# Altium project ESP32_Projet.PrjPcb
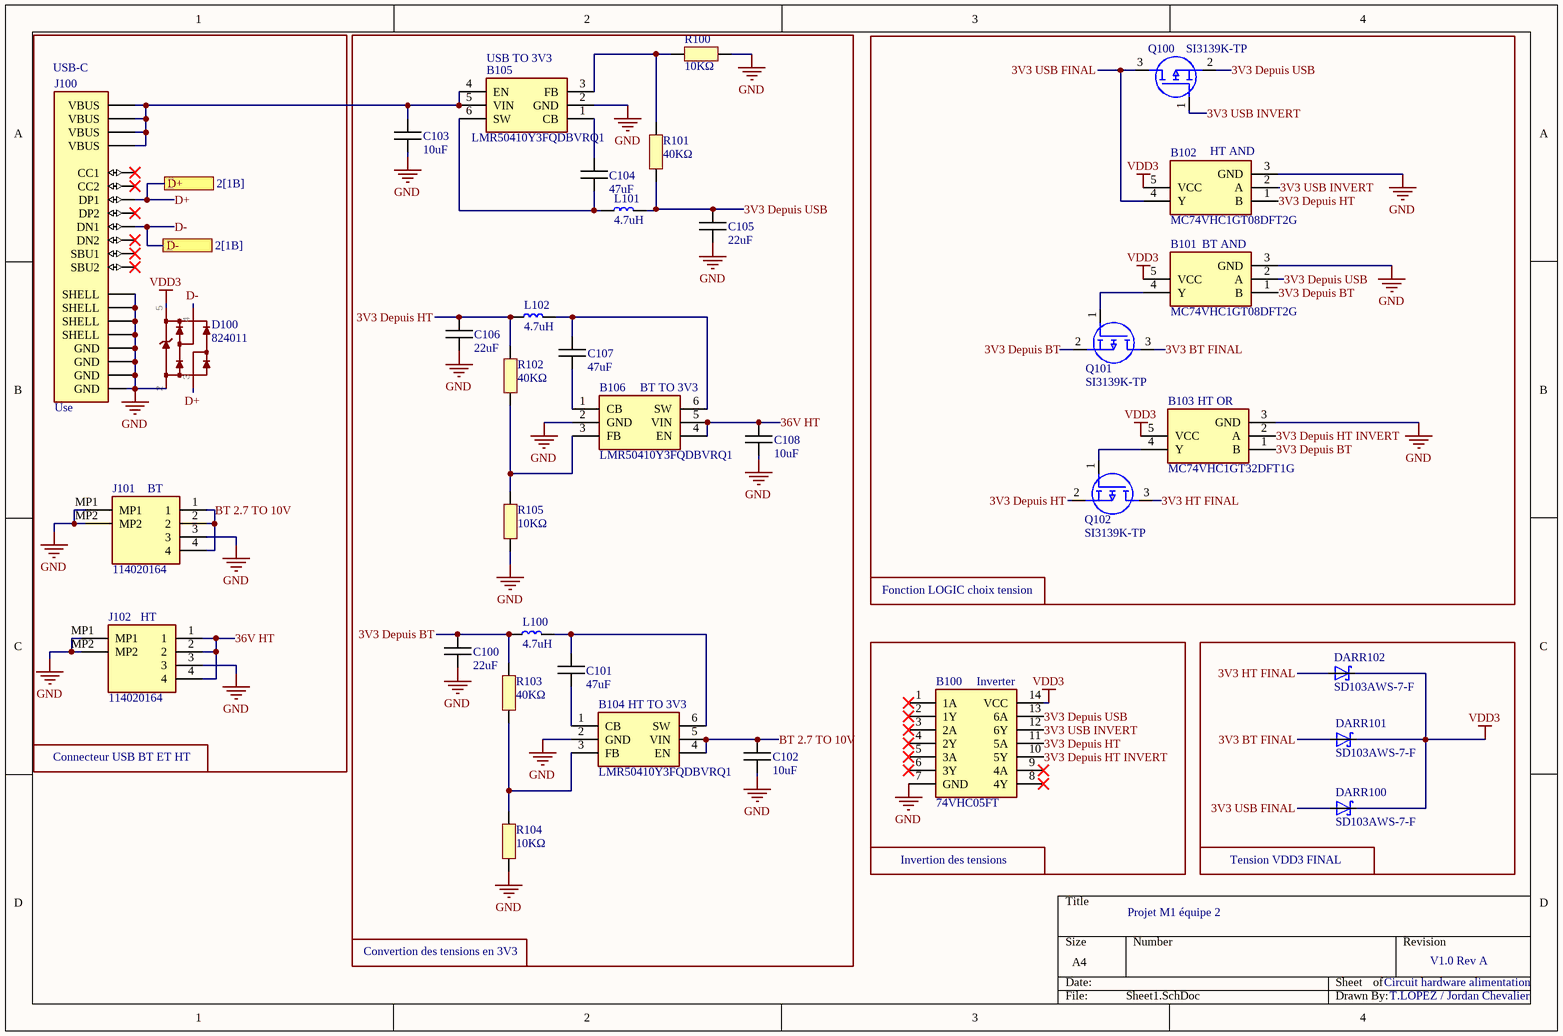
[diagram p0: Sheet1.SchDoc]
3 sheets, 76 parts. Net scope: flat (ports and power ports of the same name join across sheets).
Board file: PCB1.PcbDoc
Sheets:
  Sheet1.SchDoc
  Sheet2.SchDoc
  Sheet3.SchDoc

## Sheet Sheet1.SchDoc: Projet M1 équipe 2
size A4; Date: 18/11/2024; DrawnBy: T.LOPEZ / Jordan Chevalier; DocumentNumber: 1; Revision: V1.0 Rev A; SheetNumber: 1; SheetTotal: 3; Sheet Utility: Circuit hardware alimentation

### Parts
B100  74VHC05FT  [SOP65P640X120-14N]
B101  MC74VHC1GT08DFT2G  [SOT65P210X110-5N]
B102  MC74VHC1GT08DFT2G  [SOT65P210X110-5N]
B103  MC74VHC1GT32DFT1G  [SOT65P210X110-5N]
B104  LMR50410Y3FQDBVRQ1  [SOT95P280X145-6N]
B105  LMR50410Y3FQDBVRQ1  [SOT95P280X145-6N]
B106  LMR50410Y3FQDBVRQ1  [SOT95P280X145-6N]
C100  22uF  [CAPC1005X06N]
C101  47uF  [CAPC1005X06N]
C102  10uF  [CAPC1005X06N]
C103  10uF  [CAPC1005X06N]
C104  47uF  [CAPC1005X06N]
C105  22uF  [CAPC1005X06N]
C106  22uF  [CAPC1005X06N]
C107  47uF  [CAPC1005X06N]
C108  10uF  [CAPC1005X06N]
D100  824011  [824011]
DARR100  SD103AWS-7-F  [SD103AWS-7-F]
DARR101  SD103AWS-7-F  [SD103AWS-7-F]
DARR102  SD103AWS-7-F  [SD103AWS-7-F]
J100  Use  [USB4085-GF-A]
J101  114020164  [114020164]
J102  114020164  [114020164]
L100  4.7uH  [LQPC1005X06N]
L101  4.7uH  [LQPC1005X06N]
L102  4.7uH  [LQPC1005X06N]
Q100  SI3139K-TP  [SI3139K-TP]
Q101  SI3139K-TP  [SI3139K-TP]
Q102  SI3139K-TP  [SI3139K-TP]
R100  10KΩ  [RESC1005X06N]
R101  40KΩ  [RESC1005X06N]
R102  40KΩ  [RESC1005X06N]
R103  40KΩ  [RESC1005X06N]
R104  10KΩ  [RESC1005X06N]
R105  10KΩ  [RESC1005X06N]

### Blocks framed on the sheet
Tension VDD3 FINAL: DARR100-DARR102

### Ports
D+ (see 2[1B]), D- (see 2[1B])

### Nets
GND: B100.7(GND) B101.3(GND) B102.3(GND) B103.3(GND) B104.2(GND) B105.2(GND) B106.2(GND) C100.2 C102.2 C103.2 C105.2 C106.2 C108.2 D100.2(GND) J100.A1(GND) J100.A12(GND) J100.B1(GND) J100.B12(GND) J100.S1(SHELL) J100.S2(SHELL) J100.S3(SHELL) J100.S4(SHELL) J101.3 J101.MP1 J101.MP2 J102.3 J102.MP1 J102.MP2 R100.1 R104.1 R105.1
VDD3: B100.14(VCC) B101.5(VCC) B102.5(VCC) B103.5(VCC) D100.5(VDD) DARR100.1(C) DARR101.1(C) DARR102.1(C)  [project net GREEN LED]
3V3 BT FINAL: DARR101.2(A) Q101.3(D)
3V3 Depuis BT: B101.1(B) B103.1(B) C100.1 L100.1 Q101.2(S) R103.2
3V3 Depuis HT: B100.11(5A) B102.1(B) C106.1 L102.1 Q102.2(S) R102.2
3V3 Depuis HT INVERT: B100.10(5Y) B103.2(A)
3V3 Depuis USB: B100.13(6A) B101.2(A) C105.1 L101.2 Q100.2(S) R101.2
3V3 HT FINAL: DARR102.2(A) Q102.3(D)
3V3 USB FINAL: B102.4(Y) DARR100.2(A) Q100.3(D)
3V3 USB INVERT: B100.12(6Y) B102.2(A) Q100.1(G)
36V HT: B106.4(EN) B106.5(VIN) C108.1 J102.1 J102.2 J102.4
BT 2.7 TO 10V: B104.4(EN) B104.5(VIN) C102.1 J101.1 J101.2 J101.4
D+: D100.3 J100.A6(DP1) ; port D+
D-: D100.4 J100.A7(DN1) ; port D-
NetB101_4: B101.4(Y) Q101.1(G)
NetB103_4: B103.4(Y) Q102.1(G)
NetB104_1: B104.1(CB) C101.2
NetB104_3: B104.3(FB) R103.1 R104.2
NetB104_6: B104.6(SW) C101.1 L100.2
NetB105_1: B105.1(CB) C104.2
NetB105_3: B105.3(FB) R100.2 R101.1
NetB105_4: B105.4(EN) B105.5(VIN) C103.1 J100.A4(VBUS) J100.A9(VBUS) J100.B4(VBUS) J100.B9(VBUS)
NetB105_6: B105.6(SW) C104.1 L101.1
NetB106_1: B106.1(CB) C107.2
NetB106_3: B106.3(FB) R102.1 R105.2
NetB106_6: B106.6(SW) C107.1 L102.2

Not connected (* = marked no-connect by the designer): B100 1(1A)* 2(1Y)* 3(2A)* 4(2Y)* 5(3A)* 6(3Y)* 8(4Y)* 9(4A)*; J100 A5(CC1)* A8(SBU1)* B5(CC2)* B6(DP2)* B7(DN2)* B8(SBU2)*

### Notes on the sheet
- (near J100) USB-C
- (near B105) USB TO 3V3
- (near B102) HT AND
- (near B101) BT AND
- (near B106) BT TO 3V3
- (near B103) HT OR
- (near J101) BT
- (near J102) HT
- Fonction LOGIC choix tension
- (near B104) HT TO 3V3
- (near B100) Inverter
- Connecteur USB BT ET HT
- Invertion des tensions
- Convertion des tensions en 3V3

### Library data of the parts
B100 = 74VHC05FT: Logic Gates CMOS LOGIC IC INVERTER; Manufacturer_Name: Toshiba; Manufacturer_Part_Number: 74VHC05FT; Mouser Part Number: 757-74VHC05FT
B101 B102 = MC74VHC1GT08DFT2G: Single 2-Input AND Gate, TTL Level; Manufacturer_Name: onsemi; Manufacturer_Part_Number: MC74VHC1GT08DFT2G; Parameter 3: *
B103 = MC74VHC1GT32DFT1G: Single 2-Input OR Gate, TTL Level; Manufacturer_Name: onsemi; Manufacturer_Part_Number: MC74VHC1GT32DFT1G; Mouser Part Number: 863-C74VHC1GT32DFT1G
B104-B106 = LMR50410Y3FQDBVRQ1: Régulateurs de tension de commutation Automotive qualified SIMPLE SWITCHER 4-V to 36-V, 1-A synchronous step-down converter 6-SOT-23 -40 to 150; Manufacturer_Name: Texas Instruments; Manufacturer_Part_Number: LMR50410Y3FQDBVRQ1; Mouser Part Number: 595-R50410Y3FQDBVRQ1
C100-C108 = Capacitor
D100 = 824011: TVS Diode Array WE-TVS, High Speed Series  - Low capazity - No leakage current - Low clamping voltage - high ESD voltage protection  -- USB 1.0 - 2.0
DARR100-DARR102 = SD103AWS-7-F: Diode Array 3 Independent Schottky 40V 175mA Surface Mount 6-TSSOP, SC-88, SOT-363
J100 = USB4085-GF-A: Connecteurs USB USB Type C, 2.0, Rec, TH , G/F, RA , Top Mnt, T & R
J101 J102 = 114020164: Seeed Studio Accessories Grove Female Header - SMD-4P-2.0mm-90D-20Pcs; Manufacturer_Name: Seeed Studio; Manufacturer_Part_Number: 114020164; Mouser Part Number: 713-114020164
L100-L102 = Bobine
Q100-Q102 = SI3139K-TP: MOSFET P-Channel MOSFET
R100-R105 = Resistor

## Sheet Sheet2.SchDoc: Projet M1 Equipe 2
size A4; DrawnBy: Jordan Chevalier; DocumentNumber: 1; Revision: V1.0 Rev A; SheetNumber: 2; SheetTotal: 3
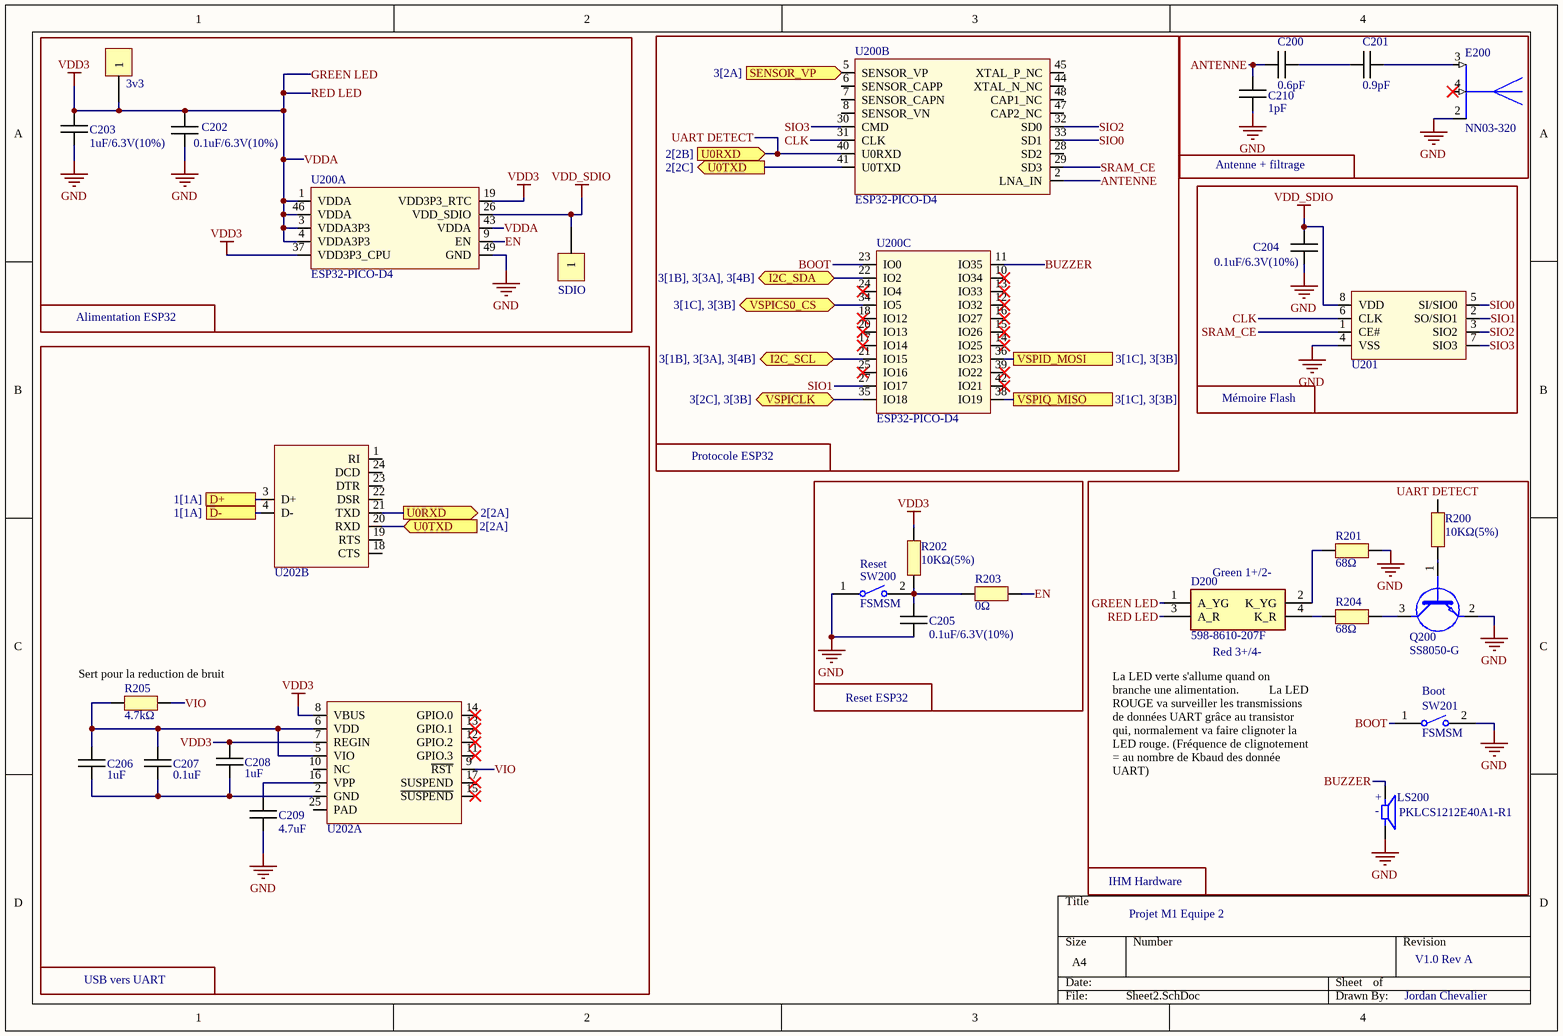
[diagram p1: Sheet2.SchDoc]

### Parts
3v3  Plage CMS 10x5  [Plage CMS 10x5]  (value not drawn)  (no BOM)
C200  0.6pF  [CAPC1005X06N]
C201  0.9pF  [CAPC1005X06N]
C202  0.1uF/6.3V(10%)  [CAPC1005X06N]
C203  1uF/6.3V(10%)  [CAPC1005X06N]
C204  0.1uF/6.3V(10%)  [CAPC1005X06N]
C205  0.1uF/6.3V(10%)  [CAPC1005X06N]
C206  1uF  [CAPC1005X06N]
C207  0.1uF  [CAPC1005X06N]
C208  1uF  [CAPC1005X06N]
C209  4.7uF  [CAPC1005X06N]
C210  1pF  [CAPC1005X06N]
D200  598-8610-207F  [5988610207F]
E200  NN03-320  [XCVR_NN03-320]
LS200  PKLCS1212E40A1-R1  [SPKR_PKLCS1212E40A1-R1]
Q200  SS8050-G  [SS8050-G]
R200  10KΩ(5%)  [RESC1005X06N]
R201  68Ω  [RESC1005X06N]
R202  10KΩ(5%)  [RESC1005X06N]
R203  0Ω  [RESC1005X06N]
R204  68Ω  [RESC1005X06N]
R205  4.7kΩ  [RESC1005X06N]
SDIO  Plage CMS 10x5  [Plage CMS 10x5]  (value not drawn)  (no BOM)
SW200  FSMSM  [TECO-FSMSM-2_V]
SW201  FSMSM  [TECO-FSMSM-2_V]
U200  ESP32-PICO-D4  [PQFN50P700X700X104_HS-49N]  (parts A,B,C of 3)
U201  IS66WVS1M8BLL-104NLI  [SOIC127P600X175-8N]  (value not drawn)
U202  CP2104-F03-GM  [PQFN50P400X400X80_HS-25N]  (value not drawn)  (parts A,B of 2)

### Blocks framed on the sheet
Alimentation ESP32: 3v3 C202 C203 SDIO U200
Protocole ESP32: U200
Antenne + filtrage: C200 C201 C210 E200
Mémoire Flash: C204 U201
USB vers UART: C206-C209 R205 U202

### Ports
D+ (see 1[1A]), D- (see 1[1A]), I2C_SCL (bidir, see 3[1B], 3[3A], 3[4B]), I2C_SDA (bidir, see 3[1B], 3[3A], 3[4B]), SENSOR_VP (in, see 3[2A]), U0RXD (in, see 2[2B]), U0RXD (out, see 2[2A]), U0TXD (in, see 2[2A]), U0TXD (out, see 2[2C]), VSPICLK (bidir, see 3[2C], 3[3B]), VSPICS0_CS (bidir, see 3[1C], 3[3B]), VSPID_MOSI (see 3[1C], 3[3B]), VSPIQ_MISO (see 3[1C], 3[3B])

### Nets
GND: C202.2 C203.2 C204.2 C205.2 C209.2 C210.2 E200.2(GROUND) LS200.N Q200.2(E) R201.2 SW200.1 SW201.2 U200.49(GND) U201.4(VSS)
GREEN LED: 3v3.1 C202.1 C203.1 C208.1 D200.1(A_YG) D200.3(A_R) R202.2 U200.1(VDDA) U200.3(VDDA3P3) U200.4(VDDA3P3) U200.19(VDD3P3_RTC) U200.37(VDD3P3_CPU) U200.43(VDDA) U200.46(VDDA) U202.7(REGIN) U202.8(VBUS)  [also labelled RED LED, VDD3, VDDA]
VDD_SDIO: C204.1 SDIO.1 U200.26(VDD_SDIO) U201.8(VDD)
ANTENNE: C200.1 C210.1 U200.2(LNA_IN)
BOOT: SW201.1 U200.23(IO0)
BUZZER: LS200.P U200.11(IO35)
CLK: U200.31(CLK) U201.6(CLK)
D+: U202.3(D+) ; port D+
D-: U202.4(D-) ; port D-
EN: R203.2 U200.9(EN)
SIO0: U200.33(SD1) U201.5(SI/SIO0)
SIO1: U200.27(IO17) U201.2(SO/SIO1)
SIO2: U200.32(SD0) U201.3(SIO2)
SIO3: U200.30(CMD) U201.7(SIO3)
SRAM_CE: U200.29(SD3) U201.1(CE#)
UART DETECT: R200.2 U200.40(U0RXD) U202.21(TXD) ; port U0RXD
VIO: R205.2 U202.9(~{RST})
NetB300_2: U200.5(SENSOR_VP) ; port SENSOR_VP
NetB301_4: U200.22(IO2) ; port I2C_SDA
NetB301_5: U200.21(IO15) ; port I2C_SCL
NetB302_1: U200.34(IO5) ; port VSPICS0_CS
NetB302_3: U200.36(IO23) ; port VSPID_MOSI
NetB302_4: U200.35(IO18) ; port VSPICLK
NetC200_2: C200.2 C201.2
NetC201_1: C201.1 E200.3(FEED_BLUETOOTH)
NetC205_1: C205.1 R202.1 R203.1 SW200.2
NetC206_1: C206.1 C207.1 R205.1 U202.5(VIO) U202.6(VDD)
NetC206_2: C206.2 C207.2 C208.2 U202.2(GND)
NetC209_1: C209.1 U202.16(VPP)
NetD200_2: D200.2(K_YG) R201.1
NetD200_4: D200.4(K_R) R204.1
NetJ302_5: U200.38(IO19) ; port VSPIQ_MISO
NetQ200_1: Q200.1(B) R200.1
NetQ200_3: Q200.3(C) R204.2
NetU200_41: U200.41(U0TXD) U202.20(RXD) ; port U0TXD

Not connected (* = marked no-connect by the designer): E200 4(FEED_GNSS)*; U200 6(SENSOR_CAPP) 7(SENSOR_CAPN) 8(SENSOR_VN) 10(IO34)* 12(IO32)* 13(IO33)* 14(IO25)* 15(IO26)* 16(IO27)* 17(IO14)* 18(IO12)* 20(IO13)* 24(IO4)* 25(IO16)* 28(SD2) 39(IO22)* 42(IO21)* 44(XTAL_N_NC) 45(XTAL_P_NC) 47(CAP2_NC) 48(CAP1_NC); U202 1(RI) 10(NC) 11(GPIO.3)* 12(GPIO.2)* 13(GPIO.1)* 14(GPIO.0)* 15(~{SUSPEND})* 17(SUSPEND)* 18(CTS) 19(RTS) 22(DSR) 23(DTR) 24(DCD) 25(PAD)

### Notes on the sheet
- Reset
- (near D200) Green 1+/2-
- (near D200) Red 3+/4-
- (near R205) Sert pour la reduction de bruit
- Reset ESP32
- (near SW201) Boot
- La LED verte s'allume quand on branche une alimentation.          La LED ROUGE va surveiller les transmissions de données UART grâce au transistor qui, normalement va faire clignoter la LED rouge. (Fréquence de clignotement = au nombre de Kbaud des donnée UART)
- IHM Hardware
- (in symbol PKLCS1212E40A1-R1) +; -

### Library data of the parts
3v3 SDIO = Plage CMS 10x5: Plage de report CMS 10x5mm; PN: L30; Value: Plage CMS 10x5; Footprint_statut: ok
C200-C210 = Capacitor
D200 = 598-8610-207F: Standard LEDs - SMD Red/Green WC 80/50mcd 645/570nm; Manufacturer_Name: Dialight; Geometry.Height: 0.8mm; Manufacturer_Part_Number: 598-8610-207F; Mouser Part Number: 645-598-8610-207F; Mouser Price/Stock: https://www.mouser.co.uk/ProductDetail/Dialight/598-8610-207F?qs=7JStj%2FjQ2SFuCjosqwklHQ%3D%3D; Arrow Part Number: 598-8610-207F; Arrow Price/Stock: https://www.arrow.com/en/products/598-8610-207f/dialight?region=nac; Datasheet Link: https://media.digikey.com/pdf/Data%20Sheets/Dialight%20PDFs/598%20Series%201210%20Pkg%20Bi-Color.pdf
E200 = NN03-320: Dual port antenna booster for GNSS, Bluetooth, 5G and UWB (1561 - 1606MHz, 2400 - 2500MHz, 3400 - 3800MHz, 3100 - 4800MHz and 6000 - 10600 MHz), signal booster; Manufacturer_Name: Ignion; Manufacturer_Part_Number: NN03-320; Mouser Part Number: 128-NN03-320
LS200 = PKLCS1212E40A1-R1: Buzzers Transducer, Externally Driven Piezo 1.5V 2kHz 70dB @ 1.5V, 10cm Surface Mount Solder Pads; MF: Murata Electronics; Value: *; MP: PKLCS1212E40A1-R1; Package: None; Availability: Unavailable; Price: None
Q200 = SS8050-G: Bipolar Transistors - BJT NPN TRANSISTOR 1.5A 40V
R200-R205 = Resistor
SW200 SW201 = CMP-2000-07511-1: FSMSM Push Button Switch, 50 mA, -35 to 85 degC, 2-Pin SMD, RoHS, Bulk; Manufacturer: TE Connectivity; Actuator Length: 1.07mm; Electrical Life: 20000Cycles; Actuator Material: Polyamide; Current Rating: 50mA; Illumination Type: Illuminated; Voltage Rating (DC): 24V; Contact Resistance: 100mOhm; Case\/Package: SMD/SMT; Operating Force: 180gf; Switch Travel: 0.25mm; Max Voltage Rating (DC): 12V; Throw Configuration: SPST; Packaging: LoosePiece; Max Operating Temperature: 85degC; ELV: Compliant; Package Description: 2-Pin Surface Mount Device, Body 6 x 3.5 mm, Pitch 9.19 mm; RoHSCompliant: true; Manufacturer URL: http://www.te.com/; Contact Plating: Silver; Contact Material: Brass; Mounting Technology: SurfaceMount; Contact Current Rating: 50mA; Datasheet Version: Rev. C2, 08/2014; Datasheet URL: http://www.te.com/commerce/DocumentDelivery/DDEController?Action=showdoc&DocId=Customer+Drawing%7F1437566-3%7FC2%7Fpdf%7FEnglish%7FENG_CD_1437566-3_C2_1437566_3_1_c.dwg.pdf%7F1437566-3; Mechanical Life: 20000Cycles; Package Reference: FSMSM; REACH SVHC: Unknown; Orientation: Straight; Min Operating Temperature: -35degC; Lead Free: LeadFree; Termination: GullWing; Package Quantity: 1000; Mount: SurfaceMount
U200 = ESP32: Système RF sur puce - SoC SIP module ESP32 with 4MByte Flash, Dual Core MCU, Wi-Fi & Bluetooth Combo, LGA48-pin, 7*7mm; Manufacturer 1: Espressif Systems; Supplier 1: Digi-Key; Supplier Part Number 1: 1904-1029-1-ND; Manufacturer Part Number 1: ESP32-PICO-D4
U201 = SRAM: SRAM 8Mb, SerialRAM, 2.7V-3.6V, 104MHz, 8 pin SOIC 150 mil, RoHS; Manufacturer 1: ISSI; Supplier 1: Digi-Key; Supplier Part Number 1: 706-IS66WVS1M8BLL-104NLI-ND; Manufactuer Part Number 1: IS66WVS1M8BLL-104NLI
U202 = USBBridge: USB Bridge, USB to UART USB 2.0 UART Interface 24-QFN (4x4); Manufacturer 1: Silicon Labs; Supplier 1: Arrow Electronics; Supplier Part Number 1: CP2104-F03-GM; Manufacturer Part Number 1: CP2104-F03-GM

## Sheet Sheet3.SchDoc: Projet M1 équipe 2
size A4; DrawnBy: Jordan Chevalier; DocumentNumber: 1; Revision: V1.0 Rev A; SheetNumber: 3; SheetTotal: 3
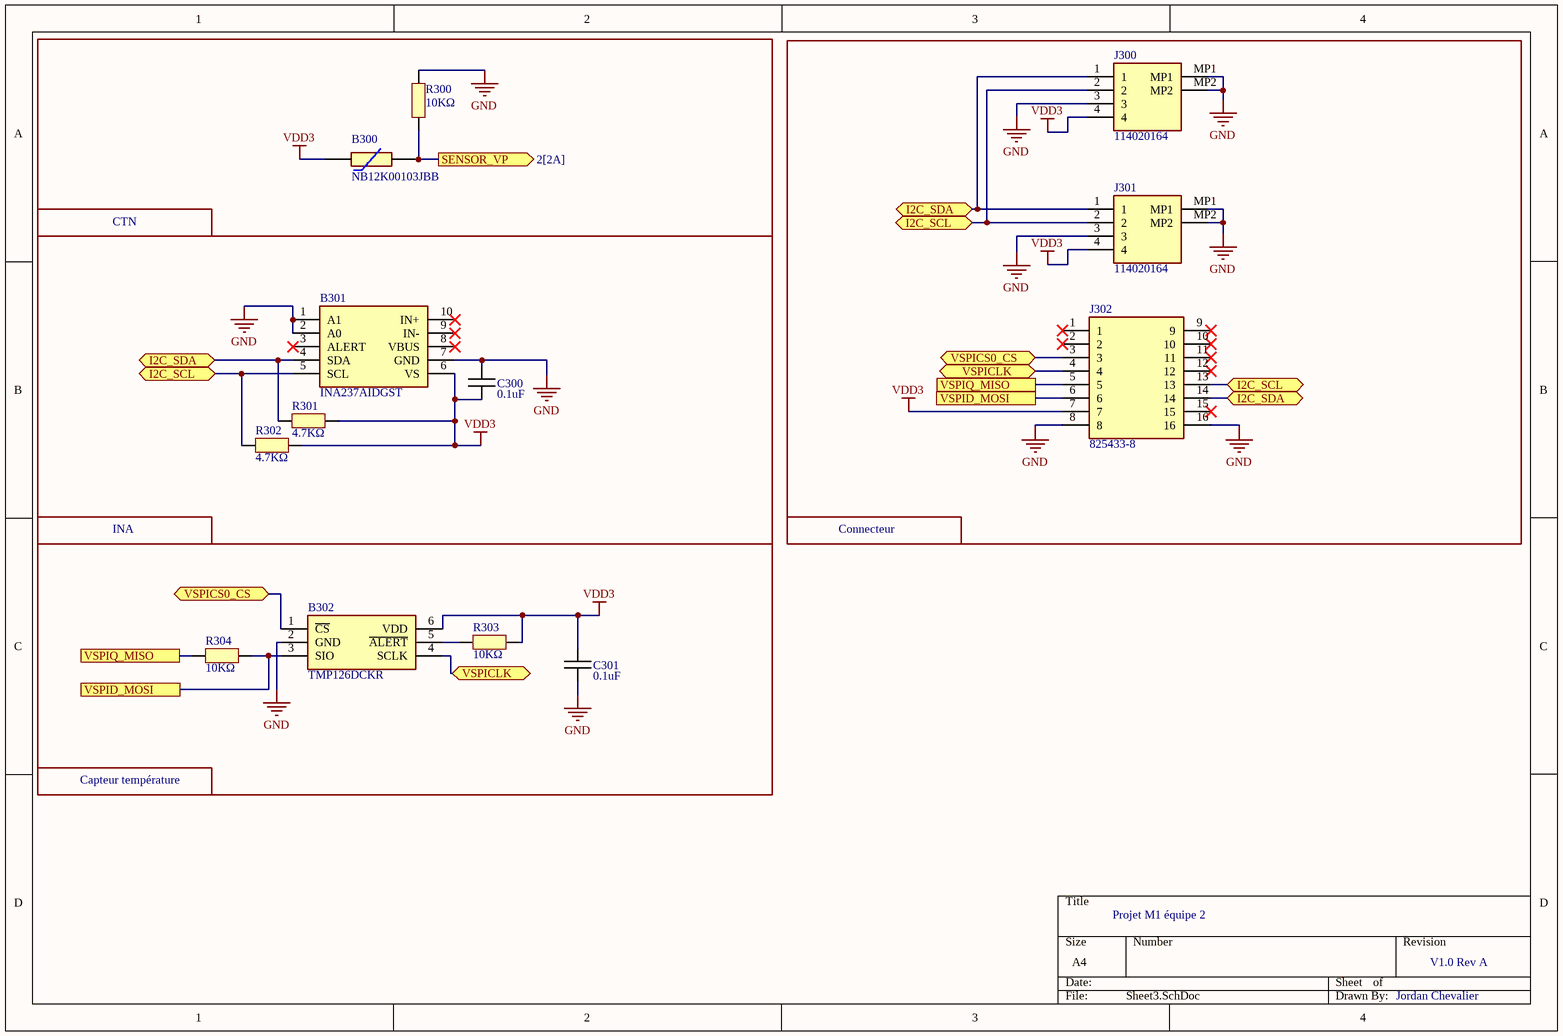
[diagram p2: Sheet3.SchDoc]

### Parts
B300  NB12K00103JBB  [RESC2212X50N]
B301  INA237AIDGST  [SOP50P490X110-10N]
B302  TMP126DCKR  [SOT65P210X110-6N]
C300  0.1uF  [CAPC1005X06N]
C301  0.1uF  [CAPC1005X06N]
J300  114020164  [114020164]
J301  114020164  [114020164]
J302  825433-8  [Connect-Mikronus]
R300  10KΩ  [RESC1005X06N]
R301  4.7KΩ  [RESC1005X06N]
R302  4.7KΩ  [RESC1005X06N]
R303  10KΩ  [RESC1005X06N]
R304  10KΩ  [RESC1005X06N]

### Blocks framed on the sheet
CTN: B300 R300
Capteur température: B302 C301 R303 R304
Connecteur: J300-J302
INA: B301 C300 R301 R302

### Ports
I2C_SCL (bidir, see 2[2B], 3[1B], 3[3A]), I2C_SCL (bidir, see 2[2B], 3[1B], 3[4B]), I2C_SCL (bidir, see 2[2B], 3[3A], 3[4B]), I2C_SDA (bidir, see 2[2B], 3[1B], 3[3A]), I2C_SDA (bidir, see 2[2B], 3[1B], 3[4B]), I2C_SDA (bidir, see 2[2B], 3[3A], 3[4B]), SENSOR_VP (out, see 2[2A]), VSPICLK (bidir, see 2[2B], 3[2C]), VSPICLK (bidir, see 2[2B], 3[3B]), VSPICS0_CS (bidir, see 2[2B], 3[1C]), VSPICS0_CS (bidir, see 2[2B], 3[3B]), VSPID_MOSI (see 2[3B], 3[1C]), VSPID_MOSI (see 2[3B], 3[3B]), VSPIQ_MISO (see 2[3B], 3[1C]), VSPIQ_MISO (see 2[3B], 3[3B])

### Nets
GND: B301.1(A1) B301.2(A0) B301.7(GND) B302.2(GND) C300.1 C301.2 J300.3 J300.MP1 J300.MP2 J301.3 J301.MP1 J301.MP2 J302.8 J302.16 R300.2
VDD3: B300.1 B301.6(VS) B302.6(VDD) C300.2 C301.1 J300.4 J301.4 J302.7 R301.2 R302.2 R303.2  [project net GREEN LED]
NetB300_2: B300.2 R300.1 ; port SENSOR_VP
NetB301_4: B301.4(SDA) J300.1 J301.1 J302.14 R301.1 ; port I2C_SDA
NetB301_5: B301.5(SCL) J300.2 J301.2 J302.13 R302.1 ; port I2C_SCL
NetB302_1: B302.1(~{CS}) J302.3 ; port VSPICS0_CS
NetB302_3: B302.3(SIO) J302.6 R304.2 ; port VSPID_MOSI
NetB302_4: B302.4(SCLK) J302.4 ; port VSPICLK
NetB302_5: B302.5(~{ALERT}) R303.1
NetJ302_5: J302.5 R304.1 ; port VSPIQ_MISO

Not connected (* = marked no-connect by the designer): B301 3(ALERT)* 8(VBUS)* 9(IN-)* 10(IN+)*; J302 1* 2* 9* 10* 11* 12* 15*

### Library data of the parts
B300 = NB12K00103JBB: NTC SMD Thermistor, NB12K, 10K, 5% AVX 10k 0805 Protection NTC Thermistor, 5s, 2 x 1.25 x 1.3mm; Manufacturer_Name: Kyocera AVX; Geometry.Height: 0.5mm; Manufacturer_Part_Number: NB12K00103JBB; Mouser Part Number: 581-NB12K00103JBB; Mouser Price/Stock: https://www.mouser.co.uk/ProductDetail/AVX/NB12K00103JBB/?qs=4%252B6%252BTdINQeDPvI%252BQUQjJ3Q%3D%3D; Arrow Part Number: NB12K00103JBB; Arrow Price/Stock: https://www.arrow.com/en/products/nb12k00103jbb/avx; Datasheet Link: https://datasheet.datasheetarchive.com/originals/distributors/Datasheets-DGA6/551314.pdf
B301 = INA237AIDGST: Current Sense Amplifiers 85-V, 16-bit, I2C output current/voltage/power monitor with alert 10-VSSOP -40 to 125; Manufacturer_Name: Texas Instruments; Manufacturer_Part_Number: INA237AIDGST; Mouser Part Number: 595-INA237AIDGST
B302 = TMP126DCKR: Board Mount Temperature Sensors +/-0.25 C SPI temperature sensor with 175 C operation, CRC and slew-rate alert; Manufacturer_Name: Texas Instruments; Manufacturer_Part_Number: TMP126DCKR; Mouser Part Number: 595-TMP126DCKR
C300 C301 = Capacitor
J300 J301 = 114020164: as J101 on sheet Sheet1; Manufacturer_Name: Seeed Studio; Manufacturer_Part_Number: 114020164; Mouser Part Number: 713-114020164
J302 = Connect-Mikrobus: Headers & Wire Housings 8P double for connection mikrobus; Manufacturer_Name: TE Connectivity; Manufacturer_Part_Number: 825433-8; Mouser Part Number: 571-825433-8
R300-R304 = Resistor

## Nets that join several sheets
GND: Sheet1 (31 pins), Sheet2 (14 pins), Sheet3 (15 pins)
GREEN LED: Sheet1 (8 pins), Sheet2 (16 pins), Sheet3 (11 pins)
D+: Sheet1 (D100.3 J100.A6), Sheet2 (U202.3)
D-: Sheet1 (D100.4 J100.A7), Sheet2 (U202.4)
NetB300_2: Sheet2 (U200.5), Sheet3 (B300.2 R300.1)
NetB301_4: Sheet2 (U200.22), Sheet3 (5 pins)
NetB301_5: Sheet2 (U200.21), Sheet3 (5 pins)
NetB302_1: Sheet2 (U200.34), Sheet3 (B302.1 J302.3)
NetB302_3: Sheet2 (U200.36), Sheet3 (B302.3 J302.6 R304.2)
NetB302_4: Sheet2 (U200.35), Sheet3 (B302.4 J302.4)
NetJ302_5: Sheet2 (U200.38), Sheet3 (J302.5 R304.1)